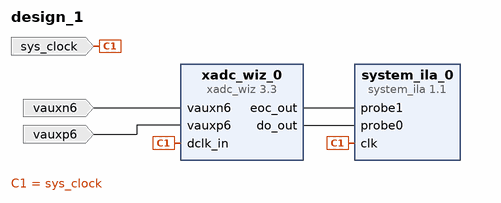
[diagram p0: block diagram of the top level]
# Vivado block design design_1, xc7z010clg400-1, Vivado 2019.2
create_bd_design design_1

create_bd_port -dir I vauxn6
create_bd_port -dir I vauxp6
create_bd_port -dir I -type clk sys_clock
set_property -dict {CONFIG.FREQ_HZ 125000000 CONFIG.PHASE 0.000} [get_bd_ports sys_clock]

create_bd_cell -type ip -vlnv xilinx.com:ip:xadc_wiz:3.3 xadc_wiz_0
set_property -dict [list \
  CONFIG.ADC_CONVERSION_RATE 1000 \
  CONFIG.CHANNEL_ENABLE_VP_VN false \
  CONFIG.DCLK_FREQUENCY 250 \
  CONFIG.ENABLE_RESET true \
  CONFIG.ENABLE_VCCDDRO_ALARM false \
  CONFIG.ENABLE_VCCPAUX_ALARM false \
  CONFIG.ENABLE_VCCPINT_ALARM false \
  CONFIG.EXTERNAL_MUX_CHANNEL VP_VN \
  CONFIG.INTERFACE_SELECTION ENABLE_DRP \
  CONFIG.OT_ALARM false \
  CONFIG.SEQUENCER_MODE Off \
  CONFIG.SINGLE_CHANNEL_ACQUISITION_TIME false \
  CONFIG.SINGLE_CHANNEL_SELECTION VAUXP6_VAUXN6 \
  CONFIG.USER_TEMP_ALARM false \
  CONFIG.VCCAUX_ALARM false \
  CONFIG.VCCINT_ALARM false \
  CONFIG.XADC_STARUP_SELECTION single_channel \
] [get_bd_cells xadc_wiz_0]
create_bd_cell -type ip -vlnv xilinx.com:ip:system_ila:1.1 system_ila_0
set_property -dict [list \
  CONFIG.C_MON_TYPE NATIVE \
  CONFIG.C_NUM_OF_PROBES 2 \
  CONFIG.C_PROBE0_TYPE 0 \
  CONFIG.C_PROBE1_TYPE 0 \
] [get_bd_cells system_ila_0]

# ---- connections ----

connect_bd_net -net vauxn6_1 [get_bd_ports vauxn6] [get_bd_pins xadc_wiz_0/vauxn6]
connect_bd_net -net vauxp6_1 [get_bd_ports vauxp6] [get_bd_pins xadc_wiz_0/vauxp6]
connect_bd_net -net eoc_out [get_bd_pins xadc_wiz_0/eoc_out] [get_bd_pins system_ila_0/probe1]
connect_bd_net -net do_out [get_bd_pins xadc_wiz_0/do_out] [get_bd_pins system_ila_0/probe0]
connect_bd_net [get_bd_ports sys_clock] [get_bd_pins xadc_wiz_0/dclk_in] [get_bd_pins system_ila_0/clk]
set_property HDL_ATTRIBUTE.DEBUG true [get_bd_nets eoc_out]
set_property HDL_ATTRIBUTE.MARK_DEBUG true [get_bd_nets eoc_out]
set_property HDL_ATTRIBUTE.DEBUG true [get_bd_nets do_out]
set_property HDL_ATTRIBUTE.MARK_DEBUG true [get_bd_nets do_out]

validate_bd_design
save_bd_design
